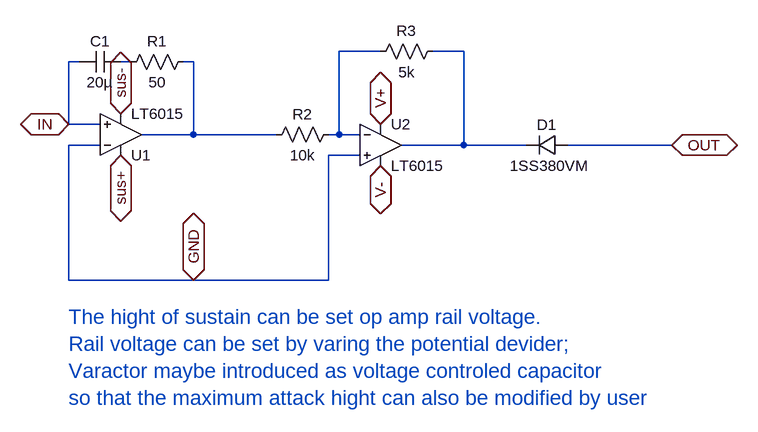
[diagram p0: schematic ADSR.asc]
ADSR.asc, the LTspice schematic file:
Version 4
SHEET 1 2628 1844
WIRE 672 -432 608 -432
WIRE 800 -432 752 -432
WIRE 208 -416 192 -416
WIRE 288 -416 272 -416
WIRE 384 -416 368 -416
WIRE 192 -320 192 -416
WIRE 240 -320 192 -320
WIRE 384 -304 384 -416
WIRE 384 -304 304 -304
WIRE 512 -304 384 -304
WIRE 608 -304 608 -432
WIRE 608 -304 592 -304
WIRE 640 -304 608 -304
WIRE 240 -288 192 -288
WIRE 800 -288 800 -432
WIRE 800 -288 704 -288
WIRE 896 -288 800 -288
WIRE 1120 -288 960 -288
WIRE 640 -272 592 -272
WIRE 192 -80 192 -288
WIRE 384 -80 192 -80
WIRE 592 -80 592 -272
WIRE 592 -80 384 -80
FLAG 272 -272 sus+
IOPIN 272 -272 BiDir
FLAG 272 -336 sus-
IOPIN 272 -336 BiDir
FLAG 672 -320 V+
IOPIN 672 -320 BiDir
FLAG 672 -256 V-
IOPIN 672 -256 BiDir
FLAG 384 -80 GND
IOPIN 384 -80 BiDir
FLAG 1120 -288 OUT
IOPIN 1120 -288 BiDir
FLAG 192 -320 IN
IOPIN 192 -320 BiDir
SYMBOL Opamps\\LT6015 272 -304 M180
SYMATTR InstName U1
SYMBOL cap 272 -432 R90
WINDOW 0 0 32 VBottom 2
WINDOW 3 32 32 VTop 2
SYMATTR InstName C1
SYMATTR Value 20µ
SYMATTR SpiceLine V=4 Irms=3.38 Rser=0.0190129 Lser=0
SYMBOL res 272 -400 R270
WINDOW 0 32 56 VTop 2
WINDOW 3 0 56 VBottom 2
SYMATTR InstName R1
SYMATTR Value 50
SYMATTR SpiceLine tol=1 pwr=0.1
SYMBOL Opamps\\LT6015 672 -288 R0
SYMATTR InstName U2
SYMBOL diode 960 -304 R90
WINDOW 0 0 32 VBottom 2
WINDOW 3 32 28 VTop 2
SYMATTR InstName D1
SYMATTR Value 1SS380VM
SYMBOL res 608 -320 R90
WINDOW 0 0 56 VBottom 2
WINDOW 3 32 56 VTop 2
SYMATTR InstName R2
SYMATTR Value 10k
SYMBOL res 768 -448 R90
WINDOW 0 0 56 VBottom 2
WINDOW 3 32 56 VTop 2
SYMATTR InstName R3
SYMATTR Value 5k
TEXT 192 -24 Left 3 ;The hight of sustain can be set op amp rail voltage. \nRail voltage can be set by varing the potential devider;\nVaractor maybe introduced as voltage controled capacitor\nso that the maximum attack hight can also be modified by user

The netlist it stands for:
* ADSR.asc
XU1 IN GND sus+ sus- N004 LT6016  ; LT6015, pins In+ In- V+ V- OUT
C1 N003 IN 20µ V=4 Irms=3.38 Rser=0.0190129 Lser=0
R1 N003 N004 50 tol=1 pwr=0.1
XU2 GND N001 V+ V- N002 LT6016  ; LT6015, pins In+ In- V+ V- OUT
D1 OUT N002 1SS380VM
R2 N001 N004 10k
R3 N002 N001 5k
.model D D
.lib standard.dio
* The hight of sustain can be set op amp rail voltage.
* Rail voltage can be set by varing the potential devider;
* Varactor maybe introduced as voltage controled capacitor
* so that the maximum attack hight can also be modified by user
.lib LTC2.lib
.backanno
.end